# EAGLE design SparkFun_Qwiic_Distance - VL53L4CX (EAGLE 9.6.2)
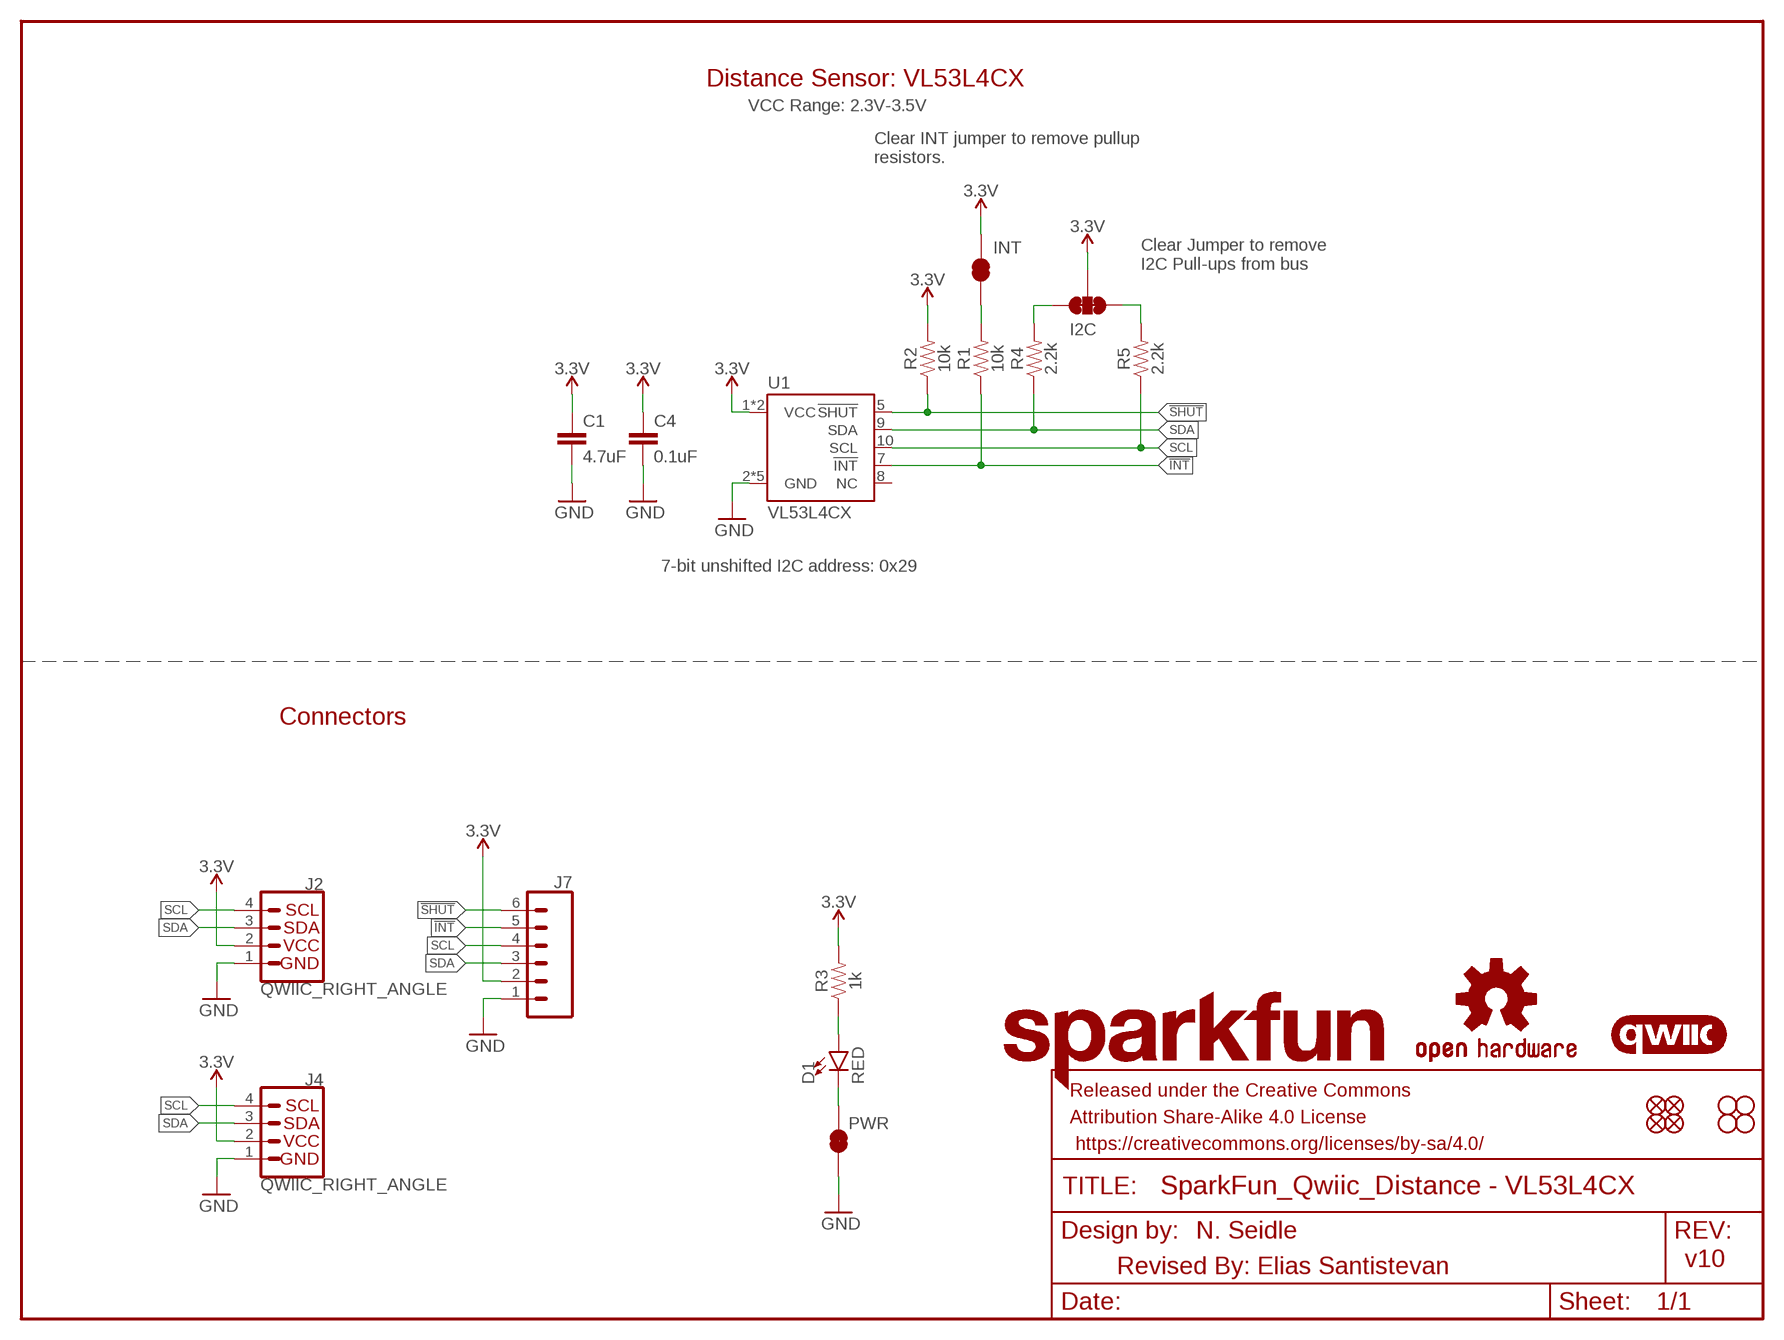
[diagram p0: schematic, sheet 1]

## Parts
C1  4.7uF  4.7UF-0603-6.3V-(10%)  [0603]
C4  0.1uF  0.1UF-0603-25V-(+80/-20%)  [0603]
D1  RED  LED-RED0603  [LED-0603]
FRAME1  FRAME-LETTER  [CREATIVE_COMMONS]
I2C  JUMPER-SMT_3_2-NC_TRACE_SILK  [SMT-JUMPER_3_2-NC_TRACE_SILK]
J2  QWIIC_RIGHT_ANGLE  QWIIC_CONNECTORJS-1MM  [JST04_1MM_RA]
J4  QWIIC_RIGHT_ANGLE  QWIIC_CONNECTORJS-1MM  [JST04_1MM_RA]
J7  CONN_06NO_SILK_NO_POP  [1X06_NO_SILK]
JP1  FIDUCIALUFIDUCIAL  [MICRO-FIDUCIAL]
JP2  FIDUCIALUFIDUCIAL  [MICRO-FIDUCIAL]
JP3  STAND-OFF  [STAND-OFF]
JP4  STAND-OFF  [STAND-OFF]
JP5  FIDUCIALUFIDUCIAL  [MICRO-FIDUCIAL]
JP6  FIDUCIALUFIDUCIAL  [MICRO-FIDUCIAL]
JP7  STAND-OFF  [STAND-OFF]
JP8  STAND-OFF  [STAND-OFF]
JP9  INT  JUMPER-SMT_2_NC_TRACE_SILK  [SMT-JUMPER_2_NC_TRACE_SILK]
LOGO1  OSHW-LOGOMINI  [OSHW-LOGO-MINI]
LOGO2  SFE_LOGO_NAME.1_INCH  [SFE_LOGO_NAME_.1]
LOGO3  QWIIC_LOGO_4MM  [QWIIC_4MM]
PWR  INT  JUMPER-SMT_2_NC_TRACE_SILK  [SMT-JUMPER_2_NC_TRACE_SILK]
R1  10k  10KOHM-0603-1/10W-1%  [0603]
R2  10k  10KOHM-0603-1/10W-1%  [0603]
R3  1k  1KOHM-0603-1/10W-1%  [0603]
R4  2.2k  2.2KOHM-0603-1/10W-1%  [0603]
R5  2.2k  2.2KOHM-0603-1/10W-1%  [0603]
U1  VL53L4CX  [VL53L4CX]

## Nets
3.3V: C1.1 C4.1 I2C.2 J2.2 J4.2 J7.2 JP9.2 R2.2 R3.2 U1.1(VCC) U1.11(VCC)
!INT: J7.5 R1.1 U1.7(!INT)
!SHUT: J7.6 R2.1 U1.5(!SHUT)
GND: C1.2 C4.2 J2.1 J4.1 J7.1 PWR.1 U1.2(GND) U1.3(GND) U1.4(GND) U1.6(GND) U1.12(GND)
N$1: I2C.1 R5.2
N$2: I2C.3 R4.2
N$3: D1.A R3.1
N$4: JP9.1 R1.2
N$5: D1.C PWR.2
SCL: J2.4 J4.4 J7.4 R5.1 U1.10(SCL)
SDA: J2.3 J4.3 J7.3 R4.1 U1.9(SDA)
Unconnected: U1.8(NC)

## Notes on the sheet
- Distance Sensor: VL53L4CX
- VCC Range: 2.3V-3.5V
- Clear INT jumper to remove pullup
  resistors.
- Clear Jumper to remove 
  I2C Pull-ups from bus
- 7-bit unshifted I2C address: 0x29
- Connectors
- N. Seidle
- Revised By: Elias Santistevan | v10

## Library data of the parts
C1 = SparkFun-Capacitors:4.7UF: 4.7µF ceramic capacitors A capacitor is a passive two-terminal electrical component used to store electrical energy temporarily in an electric field.; PROD_ID: CAP-08280
C4 = SparkFun-Capacitors:0.1UF: 0.1µF ceramic capacitors A capacitor is a passive two-terminal electrical component used to store electrical energy temporarily in an electric field.; PROD_ID: CAP-00810
D1 = SparkFun-LED:LED-RED: Red SMD LED Used in manufacturing of most products at SparkFun Packages: 0603 - SMD 0603 package [Product Link] <http://docs.avagotech.com/docs/AV02-0551EN> 0603 SMART - SMD 0603 SMART package ( more efficient and expensive)[Product Link] <http://www.osram-os.com/Graphics/XPic2/00077099_0.pdf> 1206 - SMD1206 package [Product Link] <https://www.sparkfun.com/datasheets/DevTools/LilyPad/Q150OVS4.pdff> SparkFun Products: Pro Mini 328 -5V <https://www.sparkfun.com/products/821> RedBoard <https://www.sparkfun.com/products/12757> IOIO-OTG <https://www.sparkfun.com/products/13613>; PROD_ID: DIO-00819
FRAME1 = SparkFun-Aesthetics:FRAME-LETTER: Schematic Frame - Letter Standard 8.5x11 US Letter frame
I2C = SparkFun-Jumpers:JUMPER-SMT_3_2-NC_TRACE: Normally closed trace jumper (2 of 2 connections) This jumper has a trace between all three pads so they are normally closed (NC). Use a razor knife to open the connection(s). For best results follow the IPC guidelines for cutting traces: Cutout at least 0.063 mm (0.005 in). Remove all loose material to clean up the cut area. Seal the cut with an approved epoxy. Reapply solder to reclose the connection(s).
J2 J4 = SparkFun-Connectors:QWIIC_CONNECTOR: SparkFun I2C Standard Qwiic Connector An SMD 1mm pitch JST connector makes it easy and quick (get it? Qwiic?) to connect I2C devices to each other. The Qwiic system <http://www.sparkfun.com/qwiic> enables fast and solderless connection between popular platforms and various sensors and actuators. We carry 200mm <https://www.sparkfun.com/products/14204>, 100mm <https://www.sparkfun.com/products/14205>, 50mm <https://www.sparkfun.com/products/14206>, and breadboard friendly <https://www.sparkfun.com/products/14207> Qwiic cables. We also offer 10 pcs strips <https://www.sparkfun.com/products/14323> the SMD connectors.; PROD_ID: CONN-13694
J7 = SparkFun-Connectors:CONN_06: Multi connection point. Often used as Generic Header-pin footprint for 0.1 inch spaced/style header connections On any of the 0.1 inch spaced packages, you can populate with these: Break Away Headers - Straight <https://www.sparkfun.com/products/116> (PRT-00116) Break Away Male Headers - Right Angle <https://www.sparkfun.com/products/553> (PRT-00553) Female Headers <https://www.sparkfun.com/products/115> (PRT-00115) Break Away Headers - Machine Pin <https://www.sparkfun.com/products/117> (PRT-00117) Break Away Female Headers - Swiss Machine Pin <https://www.sparkfun.com/products/743> (PRT-00743) Arduino Stackable Header - 6 Pin <https://www.sparkfun.com/products/9280> (PRT-09280) For SCREWTERMINALS and SPRING TERMINALS visit here: Screw Terimnals on SparkFun.com <https://www.sparkfun.com/search/results?term=Screw+Terminals> (5mm/3.5mm/2.54mm spacing) This device is also useful as a general connection point to wire up your design to another part of your project. Our various solder wires solder well into these plated through hole pads. Hook-Up Wire - Assortment (Stranded, 22 AWG) <https://www.sparkfun.com/products/11375> (PRT-11375) Hook-Up Wire - Assortment (Solid Core, 22 AWG) <https://www.sparkfun.com/products/11367> (PRT-11367) View the entire wire category on our website here <https://www.sparkfun.com/categories/141>
JP1 JP2 JP5 JP6 = SparkFun:FIDUCIAL: Fiducial Alignment Points Various fiducial points for machine vision alignment.
JP3 JP4 JP7 JP8 = SparkFun:STAND-OFF: Stand Off This is the mechanical footprint for a #4 phillips button head screw. Use the keepout ring to avoid running the screw head into surrounding components. SKU : PRT-00447
JP9 PWR = SparkFun-Jumpers:JUMPER-SMT_2_NC_TRACE: Normally closed trace jumper This jumper has a trace between two pads so it's normally closed (NC). Use a razor knife to open the connection. For best results follow the IPC guidelines for cutting traces: Cutout at least 0.063 mm (0.005 in). Remove all loose material to clean up the cut area. Seal the cut with an approved epoxy. Reapply solder to reclose the connection.
LOGO1 = SparkFun-Aesthetics:OSHW-LOGO: Open-Source Hardware (OSHW) Logo This logo indicates the piece of hardware it is found on incorporates a OSHW license and/or adheres to the definition of open source hardware found here: http://freedomdefined.org/OSHW
LOGO2 = SparkFun-Aesthetics:SFE_LOGO_NAME: SparkFun Font Logo This is the SparkFun name logo. The logo on the schematic will always be the same size; the package variant is the height of the flame part of the logo (or the height the flame would be, if it were drawn). Default layer for the logo on the board is tSilk.
LOGO3 = SparkFun-Aesthetics:QWIIC_LOGO: Qwiic Logos for placement on schematic and PCB. The 5.5mm silk logo is best for placing next to Qwiic connector.
R1 R2 = SparkFun-Resistors:10KOHM: 10kΩ resistor A resistor is a passive two-terminal electrical component that implements electrical resistance as a circuit element. Resistors act to reduce current flow, and, at the same time, act to lower voltage levels within circuits. - Wikipedia; PROD_ID: RES-00824
R3 = SparkFun-Resistors:1KOHM: 1kΩ resistor A resistor is a passive two-terminal electrical component that implements electrical resistance as a circuit element. Resistors act to reduce current flow, and, at the same time, act to lower voltage levels within circuits. - Wikipedia; PROD_ID: RES-07856
R4 R5 = SparkFun-Resistors:2.2KOHM: 2.2kΩ resistor A resistor is a passive two-terminal electrical component that implements electrical resistance as a circuit element. Resistors act to reduce current flow, and, at the same time, act to lower voltage levels within circuits. - Wikipedia; PROD_ID: RES-08272
U1 = DISTANCE:VL53L4CX: STMicroelectronics VL53L4X - IR Laser ToF Sensor; PROD_ID: IC-16332

## Net classes
1 power: width 0.203 mm

## Board
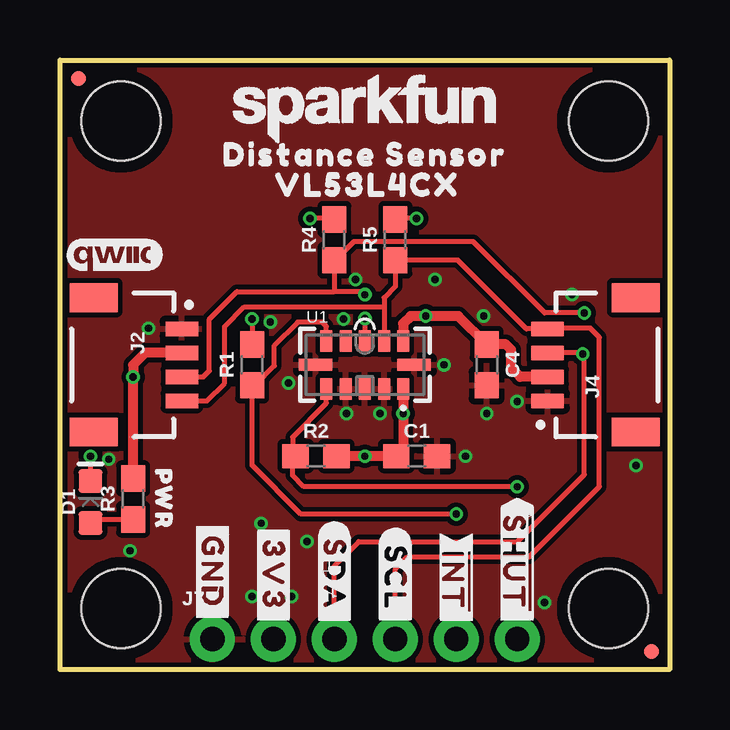
[diagram p1: board, top side]
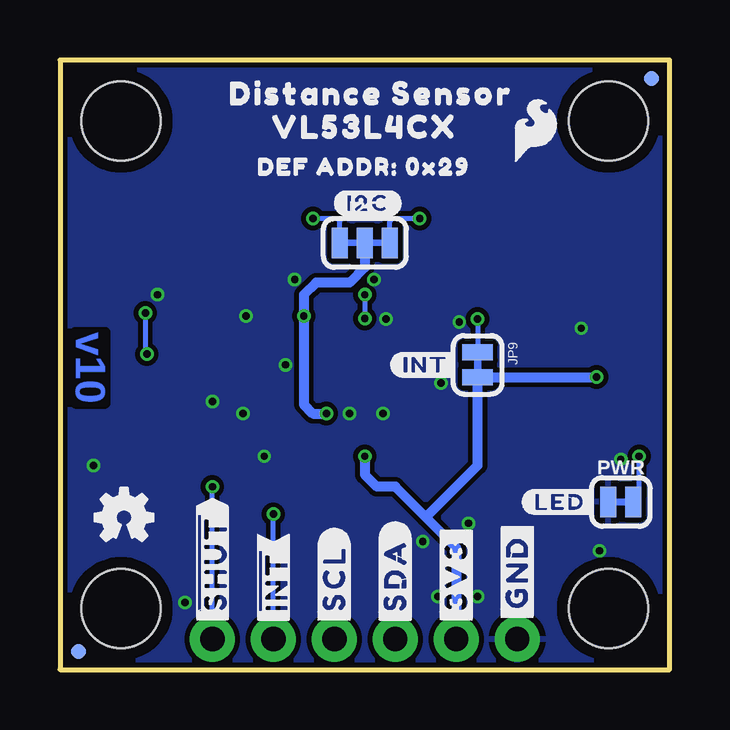
[diagram p2: board, bottom side, seen from below]

Size 25.4 x 25.4 mm. Coordinates in mm from the lower left corner, seen from the top.
Outline: 0,0 0,25.4 25.4,25.4 25.4,0 0,0
Copper layers (1*16): Top 0.035mm / dielectric 1.5mm / Bottom 0.035mm
Design rules "SparkFun-2-layer-FAB-LIMIT": minimum track width 4mil, minimum drill 6mil, track to track 4mil, track to pad 4mil, pad to pad 4mil, via to via 4mil, smd to smd 4mil, copper to edge 4mil, drill to drill 4mil, minimum pad ring 5mil, minimum via ring 5mil, stop-mask expansion 4mil, vias tented up to drill 25mil, thermal gap 10mil

### Footprints (pad centres in the part's own frame; a part is rotated, then mirrored left to right if it is on the bottom)
0603 = smd 1.1 x 1: 1 -0.85,0; 2 0.85,0
LED-0603 = smd 1 x 1: A -0.877,0; C 0.877,0
SMT-JUMPER_3_2-NC_TRACE_SILK = smd 0.66 x 1.27: 1 -1.041,0; 2 0,0; 3 1.041,0
JST04_1MM_RA = smd 0.6 x 1.35: 1 -1.5,0; 2 -0.5,0; 3 0.5,0; 4 1.5,0 | smd 1.2 x 2: NC1 2.8,-3.675; NC2 -2.8,-3.675
1X06_NO_SILK = drill 1.016 pad 1.88: 1 0,0; 2 2.54,0; 3 5.08,0; 4 7.62,0; 5 10.16,0; 6 12.7,0
MICRO-FIDUCIAL = smd 0.635 x 0.635: 1 0,0
STAND-OFF = hole 3.302: 0,0
SMT-JUMPER_2_NC_TRACE_SILK = smd 0.66 x 1.27: 1 -0.521,0; 2 0.521,0
VL53L4CX = smd 0.5 x 0.9: 1 1.6,-1; 2 0.8,-1; 3 0,-1; 4 -0.8,-1; 5 -1.6,-1; 7 -1.6,1; 8 -0.8,1; 9 0,1; 10 0.8,1; 11 1.6,1 | smd 1.4 x 0.5: 6 -2.05,0; 12 2.05,0

### Placement (x,y rotation side)
C1  14.86,8.89 0 top
C4  17.78,12.7 270 top
D1  1.27,6.99 90 top
FRAME1  -16.51,-16.51 0 top  (outside the outline)
I2C  12.7,17.78 0 bottom
J2  5.08,12.7 270 top
J4  20.32,12.7 90 top
J7  6.35,1.27 0 top
JP1  0.76,24.64 0 bottom
JP2  24.64,0.76 0 top
JP3  2.54,22.86 0 top
JP4  22.86,22.86 0 top
JP5  24.64,0.76 0 bottom
JP6  0.76,24.64 0 top
JP7  2.54,2.54 0 top
JP8  22.86,2.54 0 top
JP9  8,12.7 270 bottom
LOGO1  22.73,6.35 0 bottom
LOGO2  12.7,23.37 0 top
LOGO3  2.29,17.27 0 top
PWR  2.03,6.99 0 bottom
R1  8,12.7 90 top
R2  10.67,8.89 0 top
R3  3.05,7.11 90 top
R4  11.43,17.91 90 top
R5  13.97,17.91 90 top
U1  12.7,12.7 0 top
U$1  [##INT##7]  16.51,3.68 270 top
U$2  [##SHUT##6]  19.05,4.45 270 top
U$3  [#3V3#1]  8.89,3.94 270 top
U$4  [#GND#0]  6.35,4.06 270 top
U$5  [#I2C#56]  12.57,19.43 0 bottom
U$6  [#SCL#4]  13.97,3.81 270 top
U$7  [#SDA#5]  11.43,3.94 270 top
U$8  [DISTANCE_SENSOR8]  12.7,21.46 0 top
U$9  [VL53L4CX9]  12.83,20.19 0 top
U$10  [#LED#54]  4.57,6.99 0 bottom
U$11  [#INT#55]  10.16,12.7 0 bottom
U$12  [##INT##7]  16.51,3.68 90 bottom
U$13  [##SHUT##6]  19.05,4.45 90 bottom
U$14  [#3V3#1]  8.89,3.94 90 bottom
U$15  [#GND#0]  6.35,4.06 90 bottom
U$16  [#SCL#4]  13.97,3.81 90 bottom
U$17  [#SDA#5]  11.43,3.94 90 bottom
U$18  [DISTANCE_SENSOR8]  12.45,24 0 bottom
U$19  [VL53L4CX9]  12.7,22.61 0 bottom
U$20  [DEF_ADDR#54]  14.22,20.95 0 bottom
U$21  [0X2955]  9.65,20.95 0 bottom
U$22  [SFE_LOGO_FLAME_.1]  5.59,22.48 0 bottom
U$23  [PWR55]  4.32,7.11 270 top

### Tracks (layer width: path | path; a pad name or v marks a point on that pad's centre or on a via)
3.3V  (via drill 0.3)
  Top 0.406: U1.1 v14.3,10.67 14.3,9.18 C1.1 v12.7,8.89 R2.2 | J4.2 19.17,12.2 18.8,12.57 18.8,13.34 18.58,13.55 C4.1 16.6,14.73 v15.24,14.73 14.61,14.73 14.3,14.43 U1.11 | R3.2 v3.05,12.19 3.05,12.7 3.55,13.2 J2.2
  Bottom 0.406: 10.16,6.35 11.43,7.62 12.19,7.62 12.7,8.13 v12.7,8.89 | 10.16,6.35 8.89,5.08 J7.2 | I2C.2 12.7,16.76 13.34,16.13 14.73,16.13 15.24,15.62 v15.24,14.73 15.24,11.05 14.86,10.67 v14.3,10.67 | 10.16,6.35 8,8.51 JP9.2 3.06,12.18 v3.05,12.19
!INT  (via drill 0.3)
  Top 0.203: U1.7 11.1,14.3 10.92,14.48 9.91,14.48 8.93,13.51 8.93,12.66 8.13,11.85 R1.1 8,8.51 10.03,6.48 v16.51,6.48
  Bottom 0.203: J7.5 v16.51,6.48
!SHUT  (via drill 0.3)
  Top 0.203: U1.5 11.1,11.1 9.69,9.69 9.69,9.02 | R2.1 9.69,9.02 | v19.05,7.62 10.16,7.62 9.69,8.09 9.69,9.02
  Bottom 0.203: J7.6 v19.05,7.62
GND  (via drill 0.3)
  other vias: 3.68,14.22 11.94,10.67 13.34,10.67 9.53,11.94 16,12.7 12.32,16.26 8.76,14.48 2.03,8.76 21.34,15.62 9.65,3.05 8,3.05 8.38,6.1 10.29,5.33 17.78,10.67 19.05,11.18 2.92,4.95 24,8.51 20.19,2.79 16.89,8.89 17.65,14.73 15.62,16.26 11.81,14.61
  pour Bottom (isolate 0.203): 0,0 0,25.4 25.4,25.4 25.4,0
  pour Top (isolate 0.203): 0,0 0,25.4 25.4,25.4 25.4,0
N$1  (via drill 0.3)
  Top 0.203: v14.86,18.8 14.01,18.8 R5.2
  Bottom 0.203: I2C.1 13.74,18.69 13.84,18.8 v14.86,18.8
N$2  (via drill 0.3)
  Top 0.203: R4.2 11.39,18.8 v10.41,18.8
  Bottom 0.203: I2C.3 11.66,18.67 11.53,18.8 v10.41,18.8
N$3
  Top 0.203: D1.A 1.42,6.26 R3.1
N$4  (via drill 0.3)
  Top 0.203: v8,14.61 8,13.84
  Top 0.254: 8,13.84 R1.2
  Bottom 0.203: v8,14.61 JP9.1
N$5  (via drill 0.3)
  Top 0.203: v1.27,8.89 D1.C
  Bottom 0.203: PWR.2 1.27,7.23 v1.27,8.89
SCL
  Top 0.203: J7.4 13.97,4.19 14.48,4.7 19.56,4.7 22.48,7.62 22.48,13.84 22.1,14.22 20.34,14.22 J4.4 19.43,14.2 16.57,17.06 R5.1 13.97,15.96 13.5,15.49 13.5,15.11 | 13.5,15.11 U1.10 | J2.4 6.12,11.2 6.86,11.94 6.86,14.29 7.68,15.11 13.5,15.11
SDA  (via drill 0.3)
  Top 0.203: J7.3 11.43,4.32 12.45,5.33 19.05,5.33 21.84,8.13 21.84,13.08 v21.78,13.14 21.73,13.2 J4.3 | v21.84,14.86 20.19,14.86 17.22,17.84 12.25,17.84 11.47,17.06 R4.1 11.43,15.75 | J2.3 5.98,12.2 6.22,12.45 6.22,14.61 7.37,15.75 11.43,15.75 | v12.7,15.62 12.57,15.75 11.43,15.75 | v12.7,14.63 U1.9
  Bottom 0.203: v21.84,14.86 21.84,13.21 v21.78,13.14 | v12.7,15.62 v12.7,14.63

### Text on the board
Bottom: v10
Measures: Units in Inches
tDocu: Nate Seidle | Revised By: | Elias Santistevan